# EAGLE schematic layout (EAGLE 9.0.1)

## Sheet 1 of 3
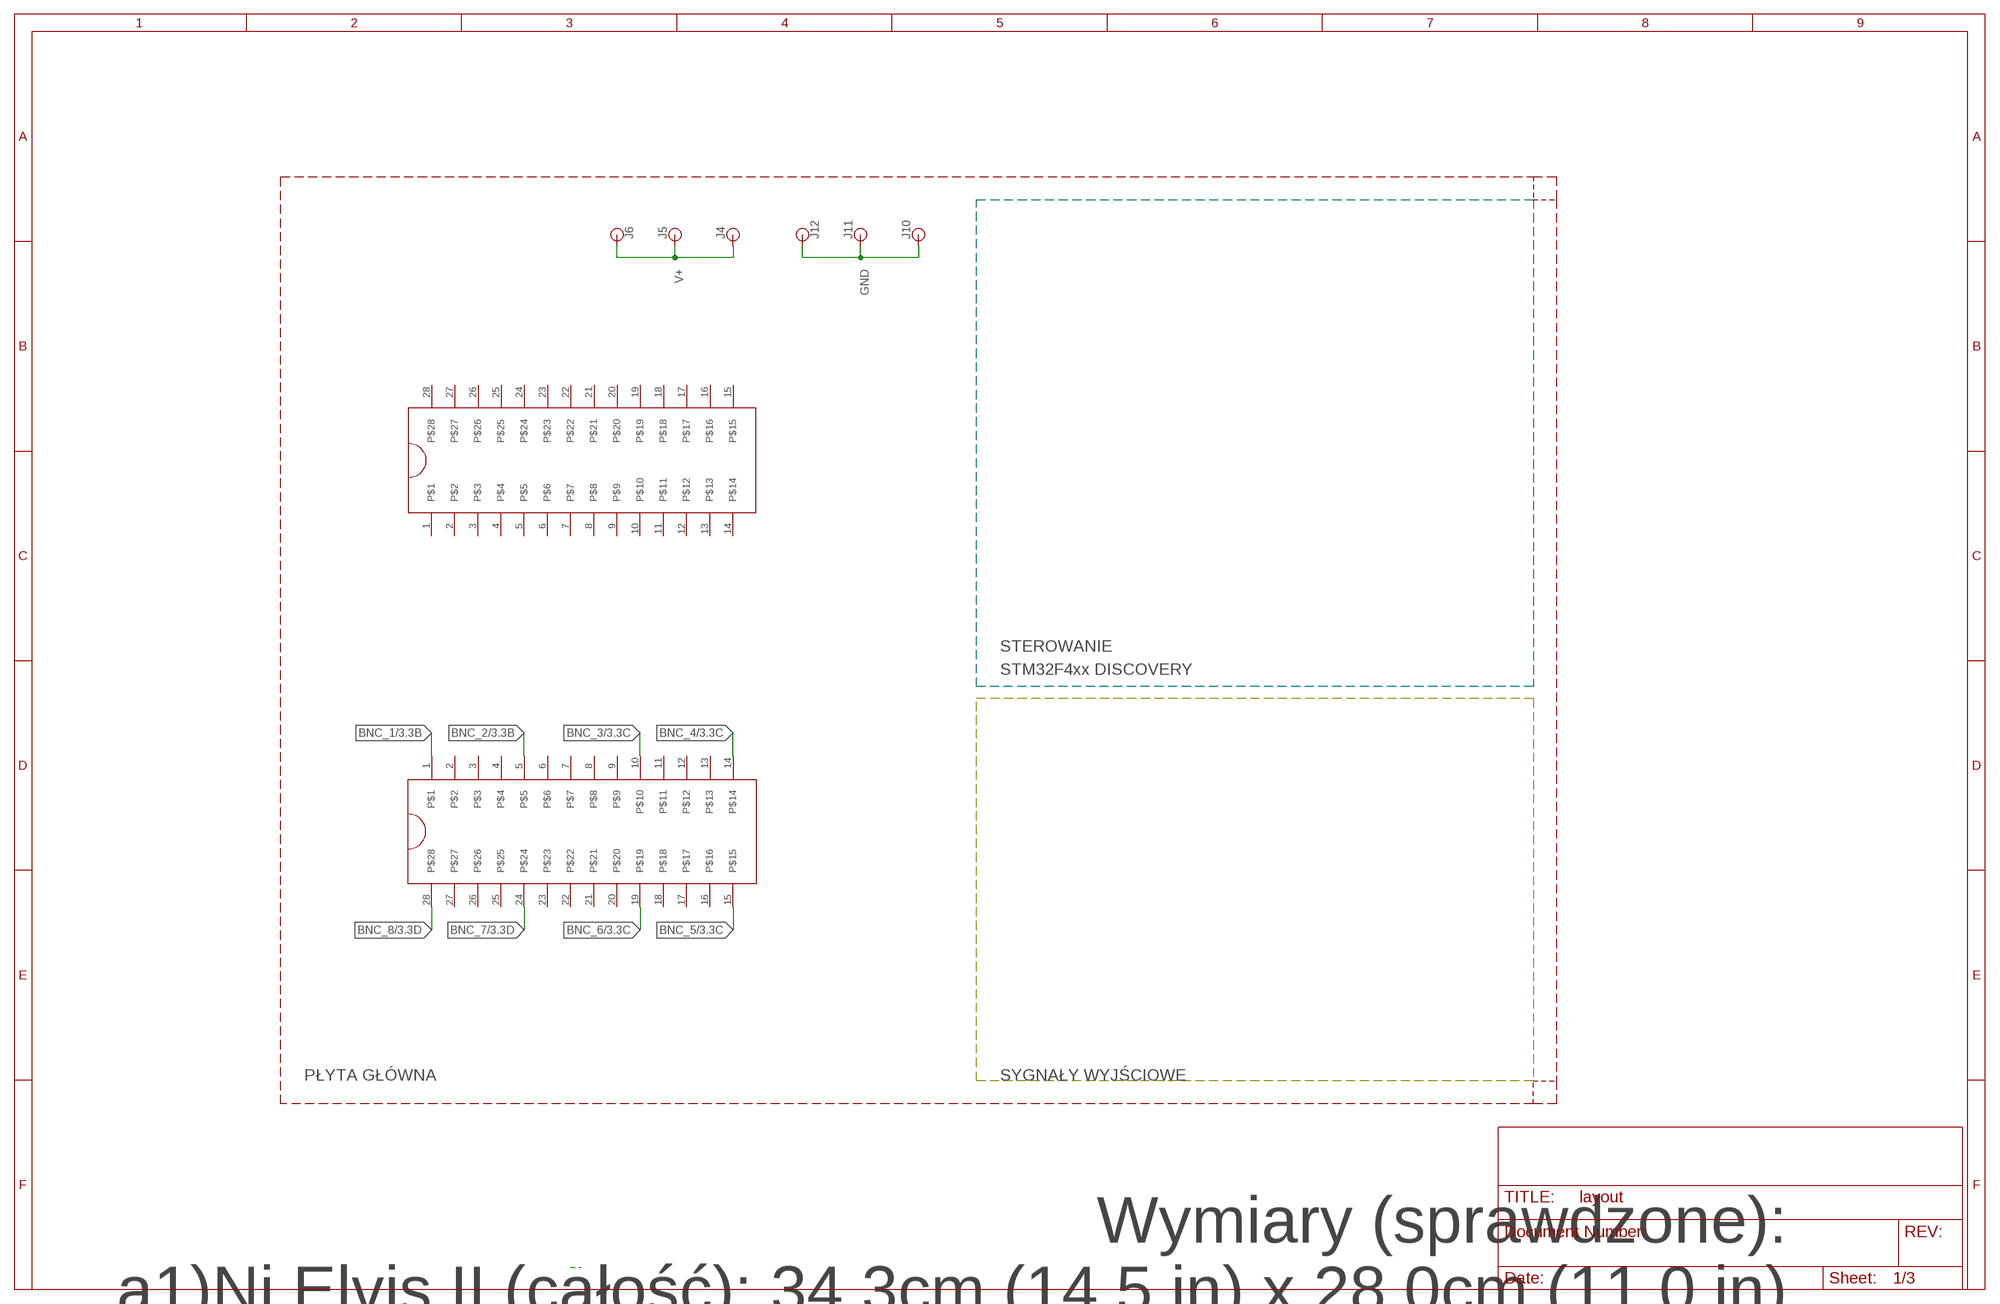
[diagram p0: schematic, sheet 1]

### Parts
J1  ZIFSOCKET-28-3"  [DIL28-3-ZIF_SOCKET]
J2  ZIFSOCKET-28-3"  [DIL28-3-ZIF_SOCKET]
J4  BANANA_CONN  [BANANA_CONN]
J5  BANANA_CONN  [BANANA_CONN]
J6  BANANA_CONN  [BANANA_CONN]
J10  BANANA_CONN  [BANANA_CONN]
J11  BANANA_CONN  [BANANA_CONN]
J12  BANANA_CONN  [BANANA_CONN]

### Nets
BNC_1: J2.1 ; also sheet 3
BNC_2: J2.5 ; also sheet 3
BNC_3: J2.10 ; also sheet 3
BNC_4: J2.14 ; also sheet 3
BNC_5: J2.15 ; also sheet 3
BNC_6: J2.19 ; also sheet 3
BNC_7: J2.24 ; also sheet 3
BNC_8: J2.28 ; also sheet 3
GND: J10.P$1 J11.P$1 J12.P$1 ; also sheet 3
V+: J4.P$1 J5.P$1 J6.P$1
Unconnected: J1.1 J1.2 J1.3 J1.4 J1.5 J1.6 J1.7 J1.8 J1.9 J1.10 J1.11 J1.12 J1.13 J1.14 J1.15 J1.16 J1.17 J1.18 J1.19 J1.20 J1.21 J1.22 J1.23 J1.24 J1.25 J1.26 J1.27 J1.28 J2.2 J2.3 J2.4 J2.6 J2.7 J2.8 J2.9 J2.11 J2.12 J2.13 J2.16 J2.17 J2.18 J2.20 J2.21 J2.22 J2.23 J2.25 J2.26 J2.27

### Notes on the sheet
- STEROWANIE
- STM32F4xx DISCOVERY
- PŁYTA GŁÓWNA | SYGNAŁY WYJŚCIOWE
- Wymiary (sprawdzone):
  a1)Ni Elvis II (całość): 34.3cm (14.5 in) x 28.0cm (11.0 in)
  a2)Ni Elvis II (płyta): 27,94cm (11in) x 21,59cm(8in) 
  b)STM32F4DISCOVERY: 9,7cm(3,81 in) x 6,6cm(2,598 in)

## Sheet 2 of 3
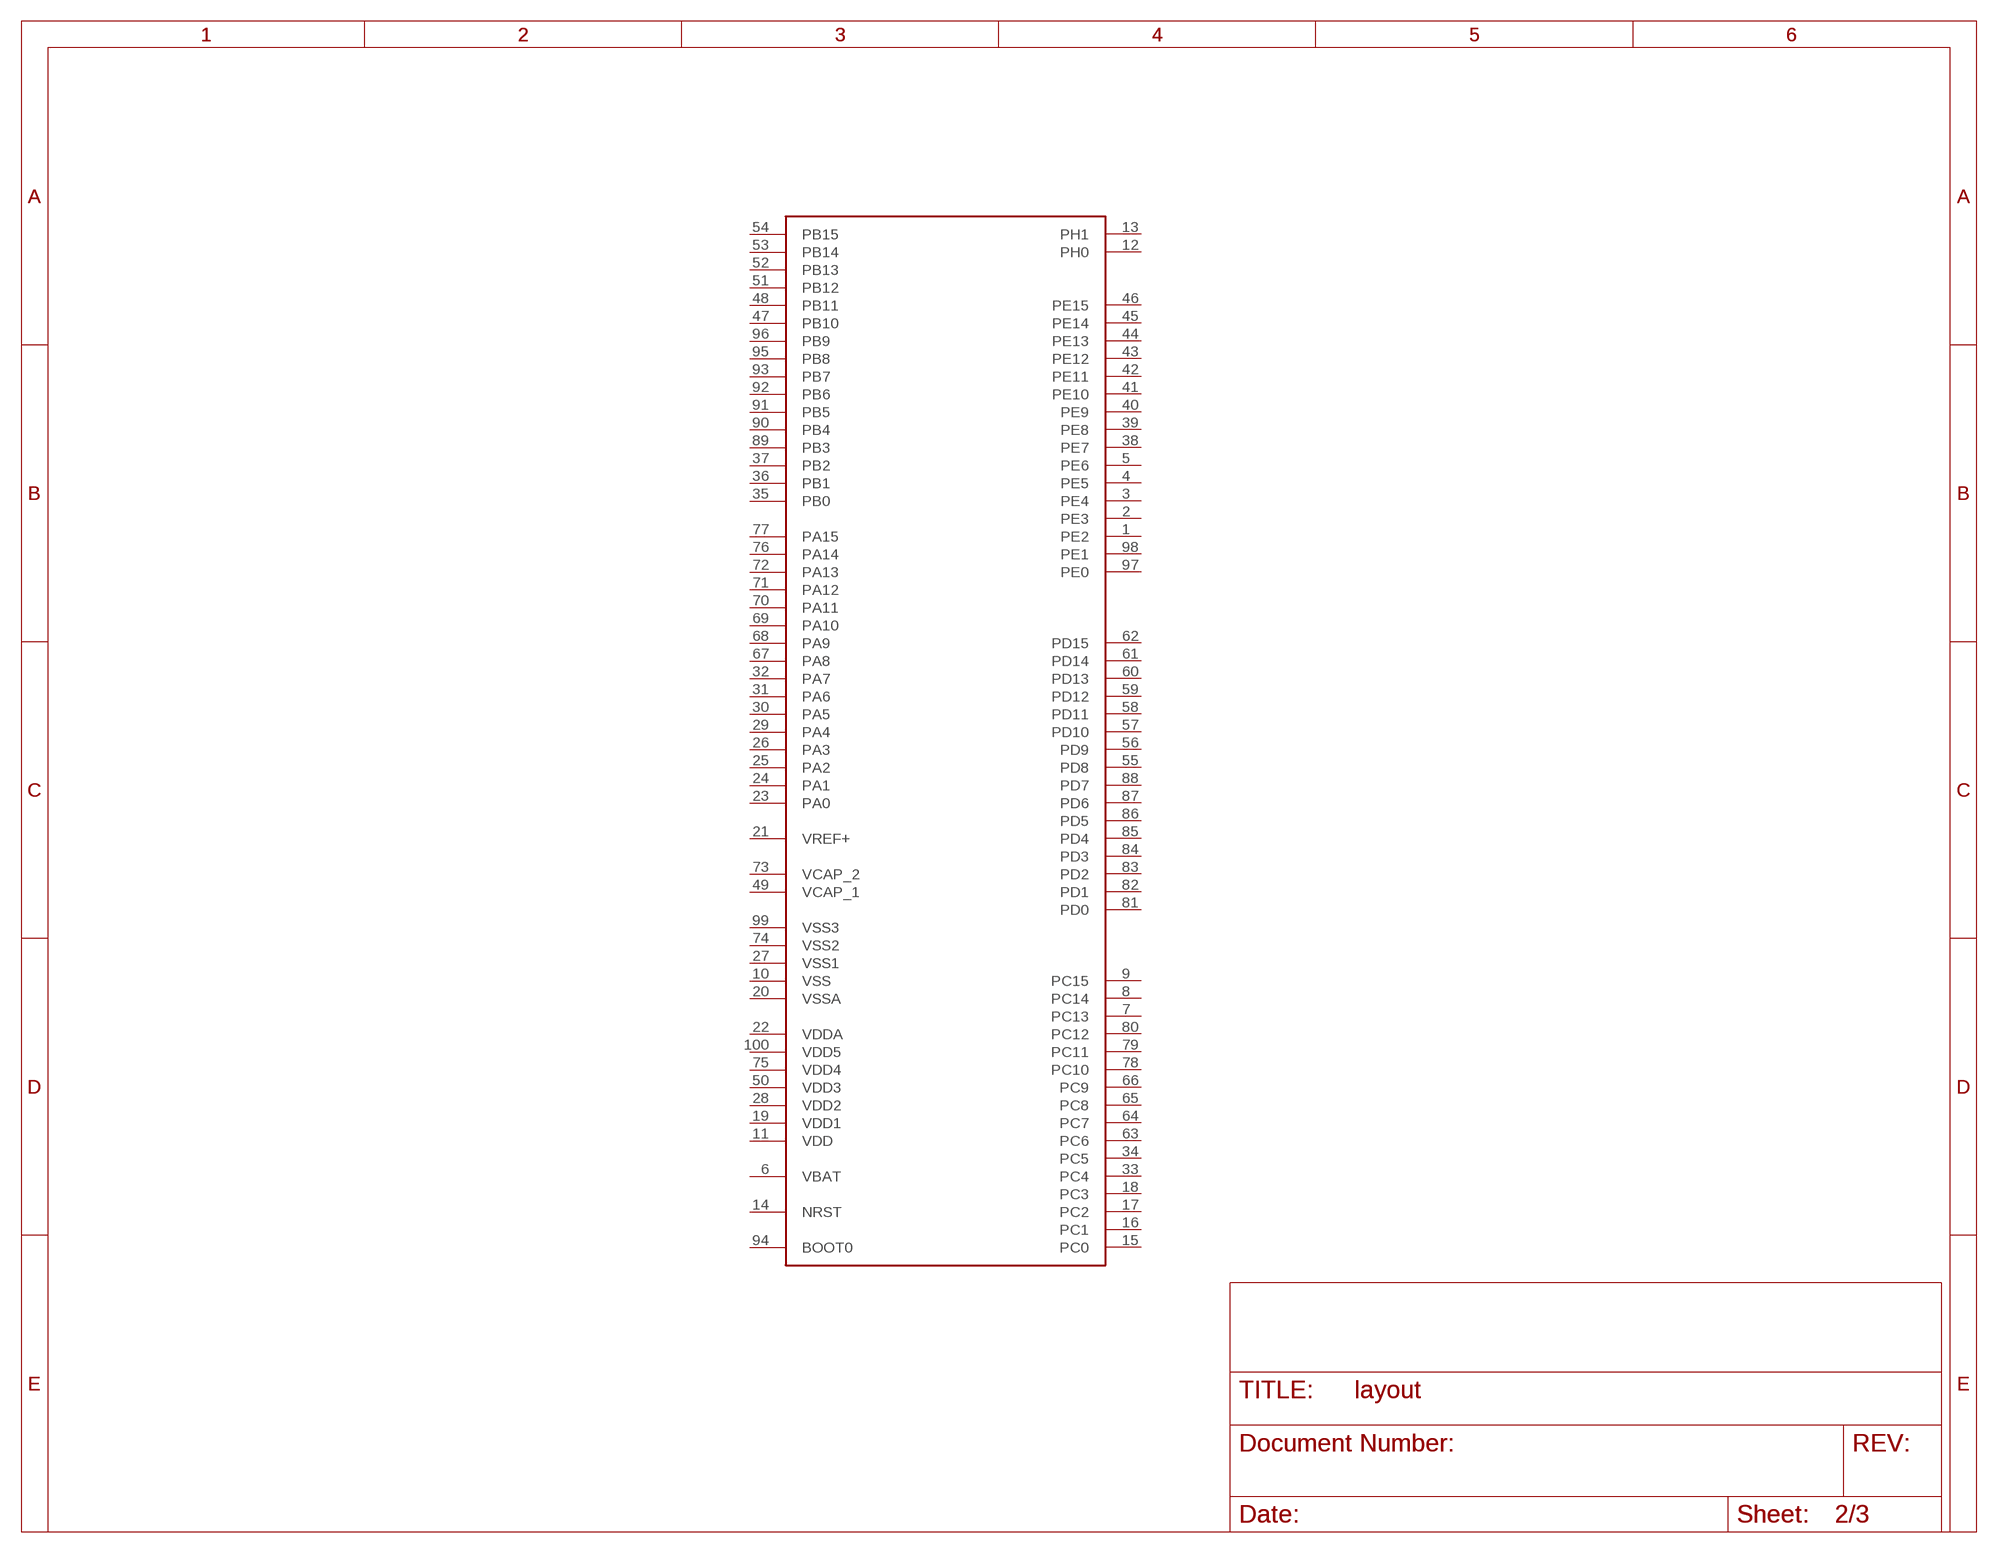
[diagram p1: schematic, sheet 2]

### Parts
U$2  STM32F40XSTM32D40X  [LQFP100]
Unconnected: U$2.1(PE2) U$2.2(PE3) U$2.3(PE4) U$2.4(PE5) U$2.5(PE6) U$2.6(VBAT) U$2.7(PC13) U$2.8(PC14) U$2.9(PC15) U$2.10(VSS) U$2.11(VDD) U$2.12(PH0) U$2.13(PH1) U$2.14(NRST) U$2.15(PC0) U$2.16(PC1) U$2.17(PC2) U$2.18(PC3) U$2.19(VDD1) U$2.20(VSSA) U$2.21(VREF+) U$2.22(VDDA) U$2.23(PA0) U$2.24(PA1) U$2.25(PA2) U$2.26(PA3) U$2.27(VSS1) U$2.28(VDD2) U$2.29(PA4) U$2.30(PA5) U$2.31(PA6) U$2.32(PA7) U$2.33(PC4) U$2.34(PC5) U$2.35(PB0) U$2.36(PB1) U$2.37(PB2) U$2.38(PE7) U$2.39(PE8) U$2.40(PE9) U$2.41(PE10) U$2.42(PE11) U$2.43(PE12) U$2.44(PE13) U$2.45(PE14) U$2.46(PE15) U$2.47(PB10) U$2.48(PB11) U$2.49(VCAP_1) U$2.50(VDD3) U$2.51(PB12) U$2.52(PB13) U$2.53(PB14) U$2.54(PB15) U$2.55(PD8) U$2.56(PD9) U$2.57(PD10) U$2.58(PD11) U$2.59(PD12) U$2.60(PD13) U$2.61(PD14) U$2.62(PD15) U$2.63(PC6) U$2.64(PC7) U$2.65(PC8) U$2.66(PC9) U$2.67(PA8) U$2.68(PA9) U$2.69(PA10) U$2.70(PA11) U$2.71(PA12) U$2.72(PA13) U$2.73(VCAP_2) U$2.74(VSS2) U$2.75(VDD4) U$2.76(PA14) U$2.77(PA15) U$2.78(PC10) U$2.79(PC11) U$2.80(PC12) U$2.81(PD0) U$2.82(PD1) U$2.83(PD2) U$2.84(PD3) U$2.85(PD4) U$2.86(PD5) U$2.87(PD6) U$2.88(PD7) U$2.89(PB3) U$2.90(PB4) U$2.91(PB5) U$2.92(PB6) U$2.93(PB7) U$2.94(BOOT0) U$2.95(PB8) U$2.96(PB9) U$2.97(PE0) U$2.98(PE1) U$2.99(VSS3) U$2.100(VDD5)

## Sheet 3 of 3
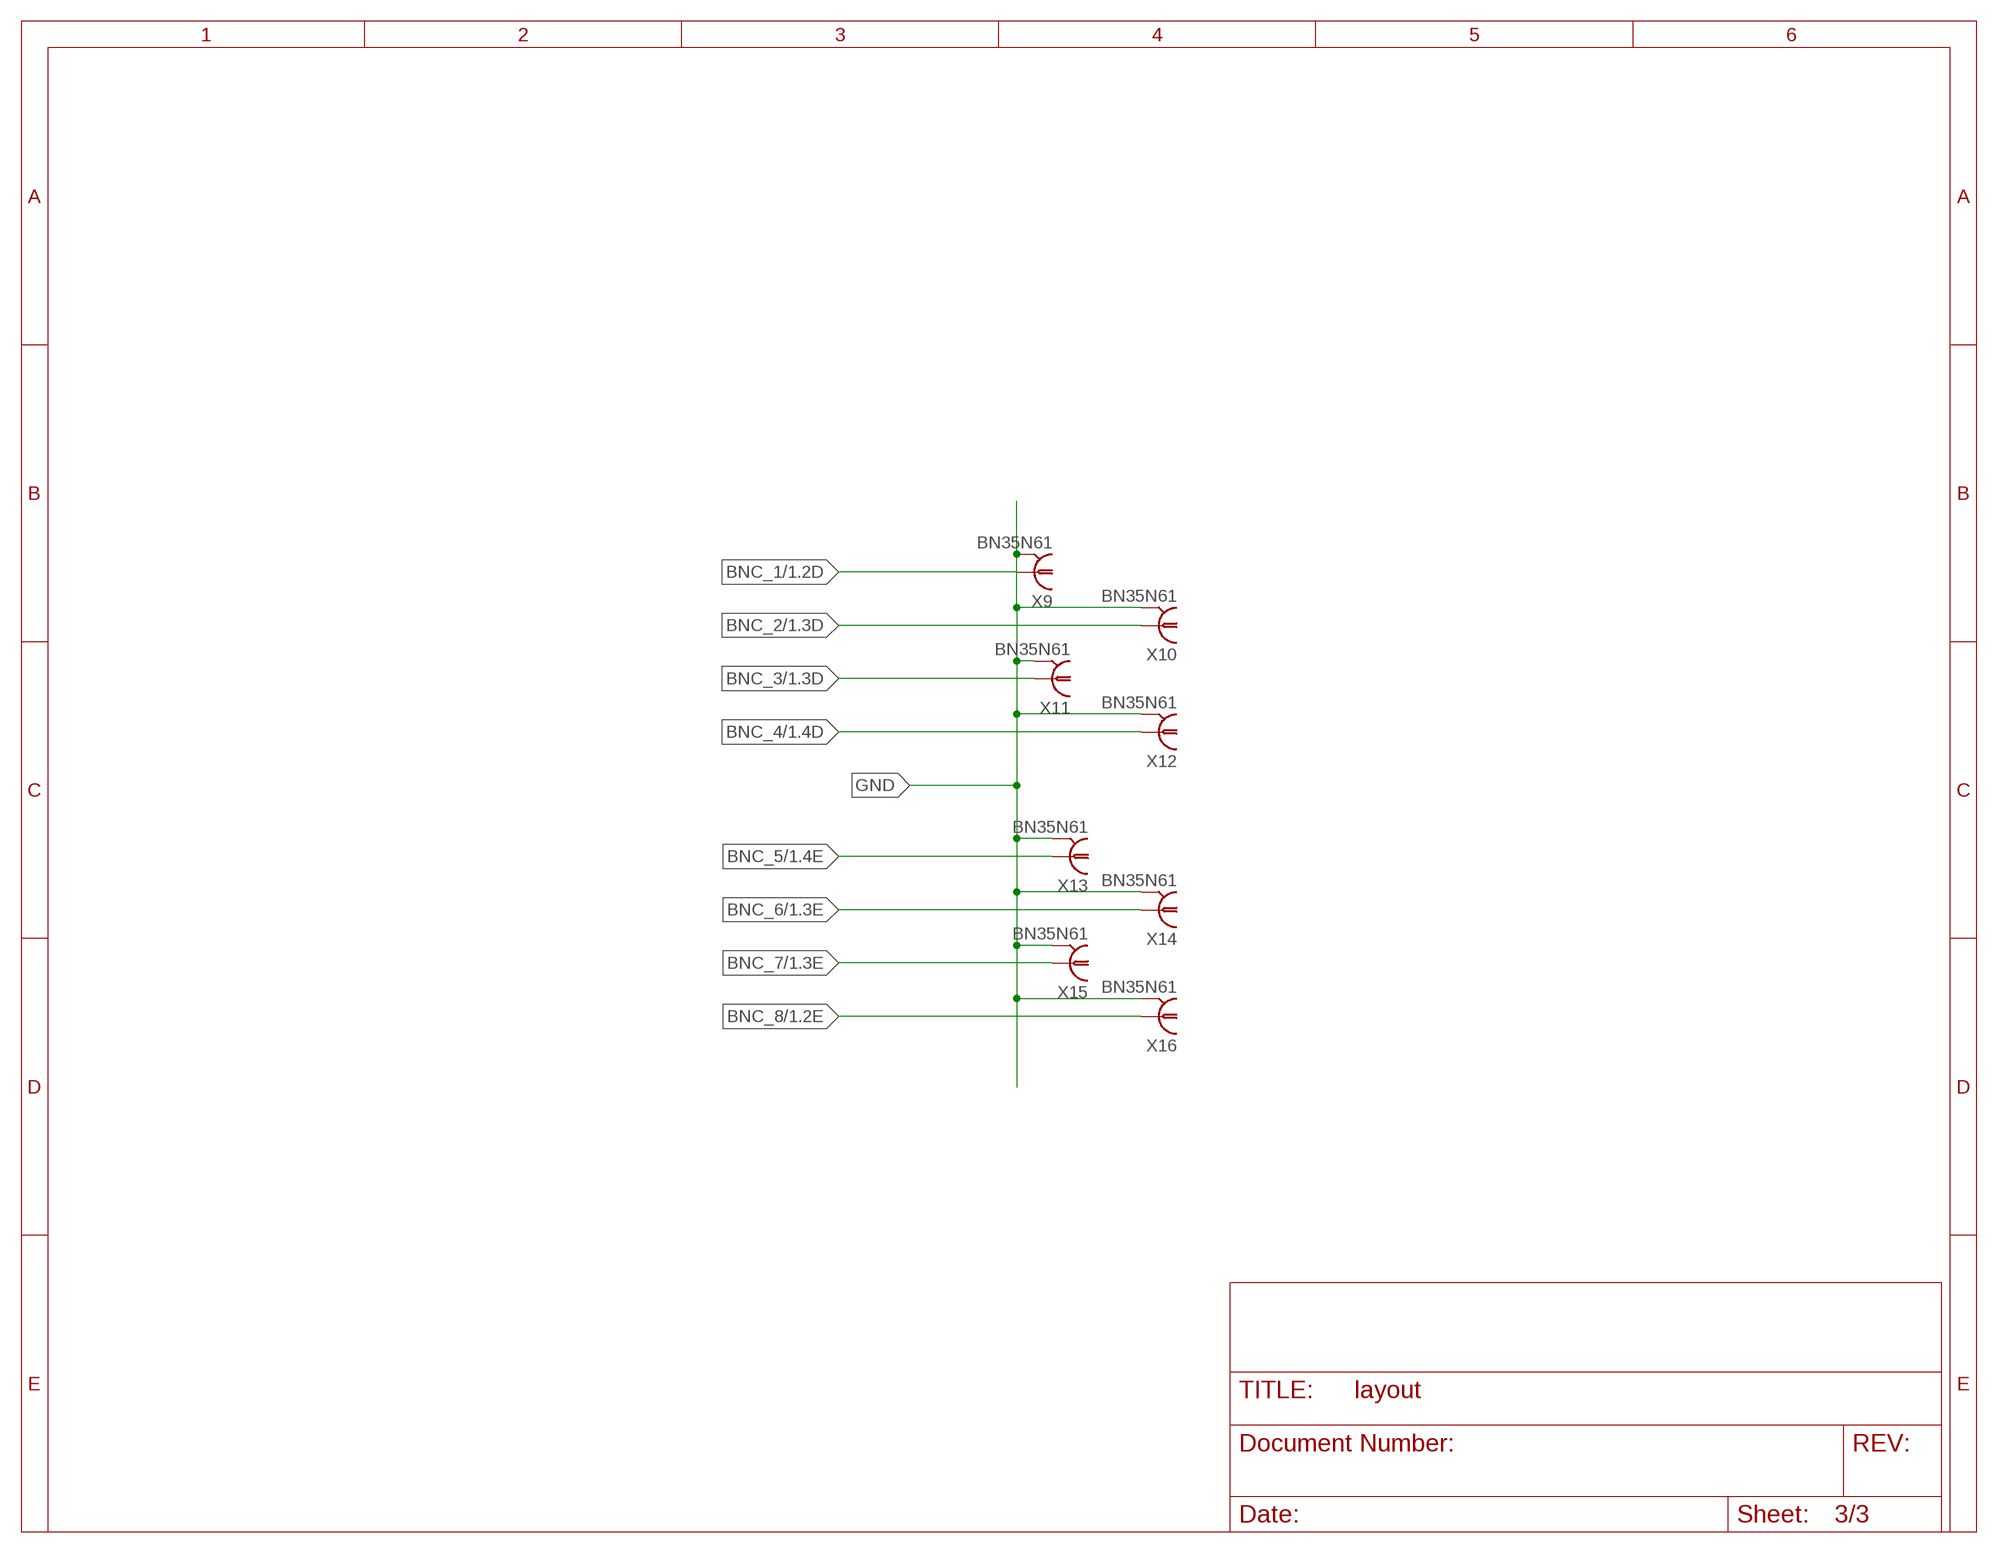
[diagram p2: schematic, sheet 3]

### Parts
X9  BN35N61  [B35N61]
X10  BN35N61  [B35N61]
X11  BN35N61  [B35N61]
X12  BN35N61  [B35N61]
X13  BN35N61  [B35N61]
X14  BN35N61  [B35N61]
X15  BN35N61  [B35N61]
X16  BN35N61  [B35N61]

### Nets
BNC_2: X10.1 ; also sheet 1
BNC_3: X11.1 ; also sheet 1
BNC_4: X12.1 ; also sheet 1
BNC_5: X13.1 ; also sheet 1
BNC_6: X14.1 ; also sheet 1
BNC_7: X15.1 ; also sheet 1
BNC_8: X16.1 ; also sheet 1
GND: X9.2 X9.3 X9.4 X9.5 X10.2 X10.3 X10.4 X10.5 X11.2 X11.3 X11.4 X11.5 X12.2 X12.3 X12.4 X12.5 X13.2 X13.3 X13.4 X13.5 X14.2 X14.3 X14.4 X14.5 X15.2 X15.3 X15.4 X15.5 X16.2 X16.3 X16.4 X16.5 ; also sheet 1
Unconnected: X9.1

## Library data of the parts
J1 J2 = SparkFun-Connectors:ZIFSOCKET-28-3: ZIF Socket 28-Pin 0.3" Lever-action ZIF socket for 28-pin ICs SparkFun Products: ZIF Socket 28-Pin <https://www.sparkfun.com/products/9175>; PROD_ID: CONN-10960; SF_ID: PRT-09175
J4-J6 J10-J12 = SparkFun-Connectors:BANANA_CONN: Through-hole Banana Jack Basic PTH connection for banana jack plugs SparkFun Products: Multimeter Kit <https://www.sparkfun.com/products/retired/10956> Banana to Alligator Cable <https://www.sparkfun.com/products/retired/509> Banana to Alligator Coax Cable <https://www.sparkfun.com/products/retired/508> Banana to Banana Cable <https://www.sparkfun.com/products/retired/507> Banana to IC Hook Cables <https://www.sparkfun.com/products/retired/506>
U$2 = stm32f:STM32F40X: Features • Core: ARM 32-bit Cortex™-M4 CPU with FPU, Adaptive real-time accelerator (ART Accelerator™) allowing 0-wait state execution from Flash memory, frequency up to 168 MHz, memory protection unit, 210 DMIPS/ 1.25 DMIPS/MHz (Dhrystone 2.1), and DSP instructions • Memories – Up to 1 Mbyte of Flash memory – Up to 192+4 Kbytes of SRAM including 64- Kbyte of CCM (core coupled memory) data RAM – Flexible static memory controller supporting Compact Flash, SRAM, PSRAM, NOR and NAND memories • LCD parallel interface, 8080/6800 modes • Clock, reset and supply management – 1.8 V to 3.6 V application supply and I/Os – POR, PDR, PVD and BOR – 4-to-26 MHz crystal oscillator – Internal 16 MHz factory-trimmed RC (1% accuracy) – 32 kHz oscillator for RTC with calibration – Internal 32 kHz RC with calibration • Low power – Sleep, Stop and Standby modes – VBAT supply for RTC, 20×32 bit backup registers + optional 4 KB backup SRAM • 3×12-bit, 2.4 MSPS A/D converters: up to 24 channels and 7.2 MSPS in triple interleaved mode • 2×12-bit D/A converters • General-purpose DMA: 16-stream DMA controller with FIFOs and burst support • Up to 17 timers: up to twelve 16-bit and two 32- bit timers up to 168 MHz, each with up to 4 IC/OC/PWM or pulse counter and quadrature (incremental) encoder input • Debug mode – Serial wire debug (SWD) & JTAG interfaces – Cortex-M4 Embedded Trace Macrocell™ • Up to 140 I/O ports with interrupt capability – Up to 136 fast I/Os up to 84 MHz – Up to 138 5 V-tolerant I/Os • Up to 15 communication interfaces – Up to 3 × I2C interfaces (SMBus/PMBus) – Up to 4 USARTs/2 UARTs (10.5 Mbit/s, ISO 7816 interface, LIN, IrDA, modem control) – Up to 3 SPIs (42 Mbits/s), 2 with muxed full-duplex I2S to achieve audio class accuracy via internal audio PLL or external clock – 2 × CAN interfaces (2.0B Active) – SDIO interface • Advanced connectivity – USB 2.0 full-speed device/host/OTG controller with on-chip PHY – USB 2.0 high-speed/full-speed device/host/OTG controller with dedicated DMA, on-chip full-speed PHY and ULPI – 10/100 Ethernet MAC with dedicated DMA: supports IEEE 1588v2 hardware, MII/RMII • 8- to 14-bit parallel camera interface up to 54 Mbytes/s • True random number generator • CRC calculation unit • 96-bit unique ID • RTC: subsecond accuracy, hardware calendar
X9-X16 = con-coax:BN35N61: BNC CONNECTOR M/A COM www.macom.com distributor Farnell 149-452; OC_FARNELL: unknown; OC_NEWARK: unknown